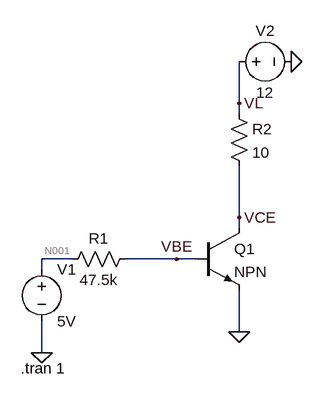
[diagram p0: schematic circuito4_cutoff.asc]
circuito4_cutoff.asc, the LTspice schematic file:
Version 4.1
SHEET 1 880 680
WIRE 336 -112 336 -176
WIRE 336 -96 336 -112
WIRE 336 64 336 -16
WIRE 336 80 336 64
WIRE 80 128 32 128
WIRE 240 128 160 128
WIRE 272 128 240 128
WIRE 32 144 32 128
WIRE 336 240 336 176
WIRE 32 272 32 224
FLAG 32 272 0
FLAG 336 240 0
FLAG 416 -176 0
FLAG 240 128 VBE
FLAG 336 64 VCE
FLAG 336 -112 VL
SYMBOL voltage 32 128 R0
WINDOW 123 0 0 Left 0
WINDOW 39 0 0 Left 0
SYMATTR InstName V1
SYMATTR Value 5V
SYMBOL res 176 112 R90
WINDOW 0 0 56 VBottom 2
WINDOW 3 32 56 VTop 2
SYMATTR InstName R1
SYMATTR Value 47.5k
SYMBOL npn 272 80 R0
SYMATTR InstName Q1
SYMBOL res 320 -112 R0
SYMATTR InstName R2
SYMATTR Value 10
SYMBOL voltage 320 -176 R270
WINDOW 0 32 56 VTop 2
WINDOW 3 -32 56 VBottom 2
WINDOW 123 0 0 Left 0
WINDOW 39 0 0 Left 0
SYMATTR InstName V2
SYMATTR Value 12
TEXT 0 296 Left 2 !.tran 1

The netlist it stands for:
* circuito4_cutoff.asc
V1 N001 0 5V
R1 VBE N001 47.5k
Q1 VCE VBE 0 0 NPN
R2 VL VCE 10
V2 VL 0 12
.model NPN NPN
.model PNP PNP
.lib standard.bjt
.tran 1
.backanno
.end

* Results of the author's LTspice run, read from the files saved beside the schematic
* Operating Point, zero values left out:
*   V(vbe) = 830.4 mV
*   V(vl) = 12 V
*   V(n001) = 5 V
*   V(vce) = 11.91 V
*   I(V1) = -87.78 µA
*   Ic(Q1) = 8.778 mA
*   Ib(Q1) = 87.78 µA
*   Ie(Q1) = -8.866 mA
*   I(V2) = -8.778 mA
*   I(R2) = 8.778 mA
*   I(R1) = -87.78 µA
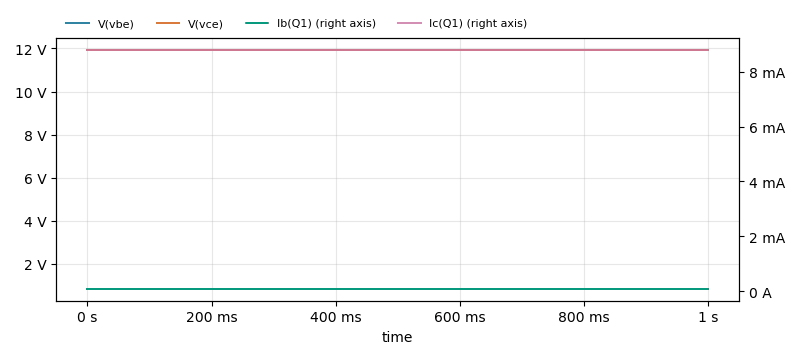
[diagram p1: Transient Analysis of circuito4_cutoff.asc, plotted from the saved traces]
* Transient Analysis, 1 run:
*   V(vbe): min 830.4 mV, max 830.4 mV, average 830.4 mV, rms 830.4 mV, last 830.4 mV
*   V(vce): min 11.91 V, max 11.91 V, average 11.91 V, rms 11.91 V, last 11.91 V
*   Ib(Q1): min 87.78 µA, max 87.78 µA, average 87.78 µA, rms 87.78 µA, last 87.78 µA
*   Ic(Q1): min 8.778 mA, max 8.778 mA, average 8.778 mA, rms 8.778 mA, last 8.778 mA